# Altium schematic sheet Sheet1.SchDoc
size A; SheetNumber: 1; SheetTotal: 1
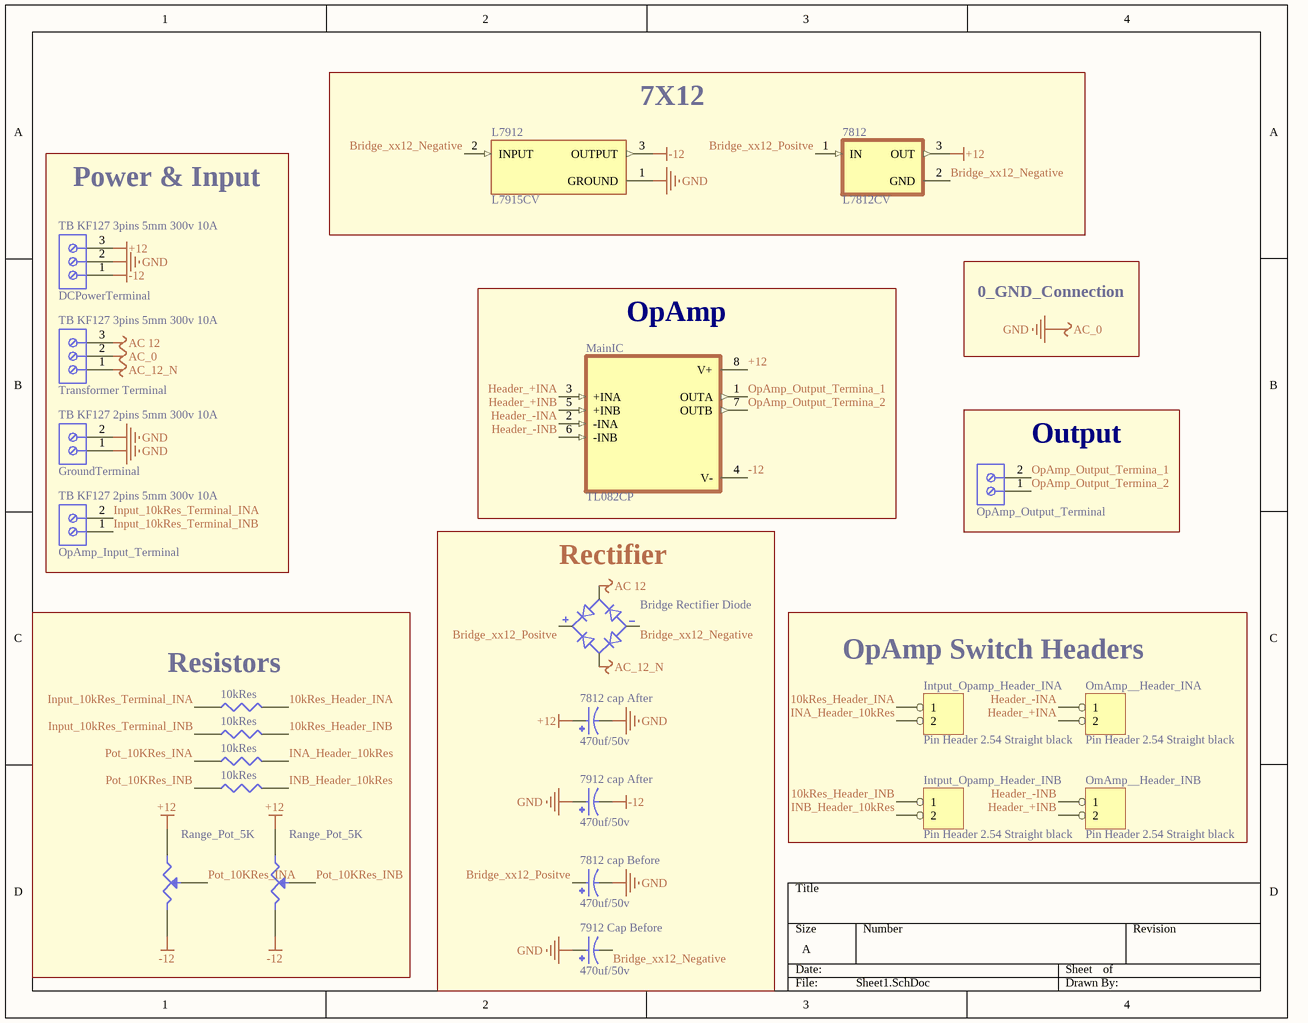
[diagram p0: Sheet1.SchDoc]

## Parts
(Parts that share a designator on the sheet are numbered #1, #2 ... from top to bottom, then left to right.)
10kRes#1  (no value)  [AXIAL0.3]
10kRes#2  RES1  [AXIAL0.3]  (value not drawn)
10kRes#3  (no value)  [AXIAL0.3]
10kRes#4  RES1  [AXIAL0.3]  (value not drawn)
7812  L7812CV  [TO-220-3]
7812_cap_After  470uf/50v  [CAPPRD500W60D1250H2000]
7812_cap_Before  470uf/50v  [CAPPRD500W60D1250H2000]
7912_cap_After  470uf/50v  [CAPPRD500W60D1250H2000]
7912_Cap_Before  470uf/50v  [CAPPRD500W60D1250H2000]
Bridge_Rectifier_Diode  DB102-BP  [DIP776W48P510L828H480Q4]  (value not drawn)
DCPowerTerminal  TB KF127 3pins 5mm 300v 10A  [691236510003]
GroundTerminal  TB KF127 2pins 5mm 300v 10A  [TE_282841-2]
Intput_Opamp_Header_INA  Pin Header 2.54 Straight black  [SIP2]
Intput_Opamp_Header_INB  Pin Header 2.54 Straight black  [SIP2]
L7912  L7915CV  [TO255P1040X460X1935-3]
MainIC  TL082CP  [DIP794W45P254L959H508Q8]
OmAmp__Header_INA  Pin Header 2.54 Straight black  [SIP2]
OmAmp__Header_INB  Pin Header 2.54 Straight black  [SIP2]
OpAmp_Input_Terminal  TB KF127 2pins 5mm 300v 10A  [TE_282841-2]
OpAmp_Output_Terminal  691101710002  [TE_282841-2]  (value not drawn)
Range_Pot_5K#1  (no value)  [POT]
Range_Pot_5K#2  POTENTIOMETER  [POT]  (value not drawn)
Transformer_Terminal  TB KF127 3pins 5mm 300v 10A  [691236510003]

## Blocks framed on the sheet
7X12: 7812 L7912
Power & Input: DCPowerTerminal GroundTerminal OpAmp_Input_Terminal Transformer_Terminal
OpAmp: MainIC
Output: OpAmp_Output_Terminal
Resistors: 10kRes#1-10kRes#4 Range_Pot_5K#1 Range_Pot_5K#2
OpAmp Switch Headers: Intput_Opamp_Header_INA Intput_Opamp_Header_INB OmAmp__Header_INA OmAmp__Header_INB

## Nets
+12: 7812.3(OUT) 7812_cap_After.P DCPowerTerminal.3 MainIC.8(V+) Range_Pot_5K#1.1 Range_Pot_5K#2.1
-12: 7912_cap_After.N DCPowerTerminal.1 L7912.3(OUTPUT) MainIC.4(V-) Range_Pot_5K#1.3 Range_Pot_5K#2.3
AC 12: Bridge_Rectifier_Diode.3(AC1) Transformer_Terminal.3
AC_0: 7812_cap_After.N 7812_cap_Before.N 7912_cap_After.P 7912_Cap_Before.P DCPowerTerminal.2 GroundTerminal.1 GroundTerminal.2 L7912.1(GROUND) Transformer_Terminal.2  [also labelled GND]
AC_12_N: Bridge_Rectifier_Diode.4(AC2) Transformer_Terminal.1
10kRes_Header_INA: 10kRes#1.2 Intput_Opamp_Header_INA.1
10kRes_Header_INB: 10kRes#2.2 Intput_Opamp_Header_INB.1
Bridge_xx12_Negative: 7812.2(GND) 7912_Cap_Before.N Bridge_Rectifier_Diode.2(NEG) L7912.2(INPUT)
Bridge_xx12_Positve: 7812.1(IN) 7812_cap_Before.P Bridge_Rectifier_Diode.1(POS)
Header_+INA: MainIC.3(+INA) OmAmp__Header_INA.2
Header_+INB: MainIC.5(+INB) OmAmp__Header_INB.2
Header_-INA: MainIC.2(-INA) OmAmp__Header_INA.1
Header_-INB: MainIC.6(-INB) OmAmp__Header_INB.1
INA_Header_10kRes: 10kRes#3.2 Intput_Opamp_Header_INA.2
INB_Header_10kRes: 10kRes#4.2 Intput_Opamp_Header_INB.2
Input_10kRes_Terminal_INA: 10kRes#1.1 OpAmp_Input_Terminal.2
Input_10kRes_Terminal_INB: 10kRes#2.1 OpAmp_Input_Terminal.1
OpAmp_Output_Termina_1: MainIC.1(OUTA) OpAmp_Output_Terminal.2
OpAmp_Output_Termina_2: MainIC.7(OUTB) OpAmp_Output_Terminal.1
Pot_10KRes_INA: 10kRes#3.1 Range_Pot_5K#1.2
Pot_10KRes_INB: 10kRes#4.1 Range_Pot_5K#2.2

## Notes on the sheet
- 0_GND_Connection
- Labels drawn without touching a wire or pin: Rectifier

## Library data of the parts
10kRes#1 10kRes#3 = RES1
7812 = L7812CV: IC REG LINEAR 12V 1.5A TO220AB; MF: {'manufacturer': u'STMicroelectronics'}; Package: None; Price: None; Value: *; MP: L7812CV; Availability: Unavailable
7812_cap_After 7812_cap_Before 7912_cap_After 7912_Cap_Before = EEUTP1V471: TP-A; MF: {'manufacturer': u'Panasonic'}; Package: None; Price: None; Value: *; MP: EEUTP1V471; Availability: Unavailable
Bridge_Rectifier_Diode = DB102-BP: MF: {'manufacturer': u'Micro Commercial Components'}; Package: None; Price: None; Value: *; MP: DB102-BP; Availability: Unavailable
DCPowerTerminal Transformer_Terminal = 691101710003: WR-TBL Series 101 Horizontal Entry Modular, THT, pitch 5mm, 3p; Manufacturer: Wurth Elektronik; Modularity: Yes; Rated Current: 16A; Working Voltage: 250V; ComponentLink1Description: Website Link; ComponentLink1URL: https://www.we-online.com/redexpert/article/691101710003?ad; ComponentLink2Description: Datasheet Link; ComponentLink2URL: https://www.we-online.com/redexpert/spec/691101710003?ad; Manufacturer Part Number: 691101710003; Category: Terminal Blocks; Match Code: WR-TBL; Mount: Through Hole; Operating Temperature Max: 105°C; Operating Temperature Min: -40°C; Packaging: Box; Application: Pressure Clamp; Number of Pins: 3; Number of Rows: 1; Orientation: Horizontal; Pitch: 5mm
GroundTerminal OpAmp_Input_Terminal OpAmp_Output_Terminal = 691101710002: WR-TBL Series 101 Horizontal Entry Modular, THT, pitch 5mm, 2p; Manufacturer: Wurth Elektronik; Modularity: Yes; Rated Current: 16A; Working Voltage: 250V; ComponentLink1Description: Website Link; ComponentLink1URL: https://www.we-online.com/redexpert/article/691101710002?ad; ComponentLink2Description: Datasheet Link; ComponentLink2URL: https://www.we-online.com/redexpert/spec/691101710002?ad; Manufacturer Part Number: 691101710002; Category: Terminal Blocks; Match Code: WR-TBL; Mount: Through Hole; Operating Temperature Max: 105°C; Operating Temperature Min: -40°C; Packaging: Box; Application: Pressure Clamp; Number of Pins: 2; Number of Rows: 1; Orientation: Horizontal; Pitch: 5mm
Intput_Opamp_Header_INA Intput_Opamp_Header_INB OmAmp__Header_INA OmAmp__Header_INB = HEADER 2
L7912 = L7915CV: L7915 Series -15 V 1.5 A Fixed Ouput Negative Voltage Regulator - TO-220; MF: {'manufacturer': u'STMicroelectronics'}; Package: None; Price: None; Value: *; MP: L7915CV; Availability: Unavailable
MainIC = TL082CP: MF: {'manufacturer': u'Texas Instruments'}; Package: None; Price: None; Value: *; MP: TL082CP; Availability: Unavailable
Range_Pot_5K#1 = POTENTIOMETER